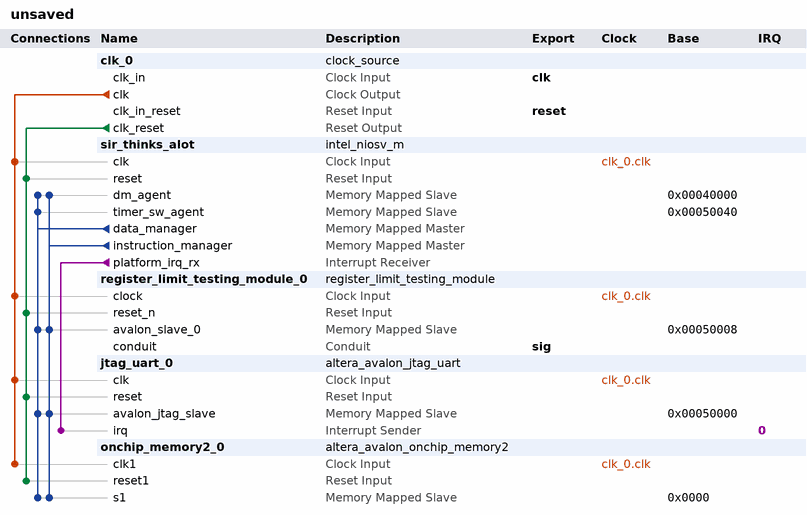
[diagram p0: system contents]
# Platform Designer (Qsys) system unsaved, Cyclone IV E EP4CE115F29C7
# Parameters at their usual value, and those the tool derives, are not listed.
package require -exact qsys 24.1
create_system unsaved
set_project_property DEVICE_FAMILY {Cyclone IV E}
set_project_property DEVICE EP4CE115F29C7

add_instance clk_0 clock_source 24.1
set_instance_parameter_value clk_0 clockFrequency 50000000

add_instance sir_thinks_alot intel_niosv_m 26.0.0
set_instance_parameter_value sir_thinks_alot enableAvalonInterface false
set_instance_parameter_value sir_thinks_alot enableDebugReset false
set_instance_parameter_value sir_thinks_alot enableECCLite false
set_instance_parameter_value sir_thinks_alot hartId 0
set_instance_parameter_value sir_thinks_alot interruptMode 0
set_instance_parameter_value sir_thinks_alot pipelineArch true
set_instance_parameter_value sir_thinks_alot resetSlave Absolute

add_instance register_limit_testing_module_0 register_limit_testing_module 1.0

add_instance jtag_uart_0 altera_avalon_jtag_uart 24.1
set_instance_parameter_value jtag_uart_0 simInteractiveOptions NO_INTERACTIVE_WINDOWS

add_instance onchip_memory2_0 altera_avalon_onchip_memory2 24.1
set_instance_parameter_value onchip_memory2_0 dataWidth 32
set_instance_parameter_value onchip_memory2_0 dualPort false
set_instance_parameter_value onchip_memory2_0 initMemContent true
set_instance_parameter_value onchip_memory2_0 initializationFileName onchip_mem.hex
set_instance_parameter_value onchip_memory2_0 memorySize 262144

# connections
add_connection clk_0.clk jtag_uart_0.clk clock
add_connection clk_0.clk onchip_memory2_0.clk1 clock
add_connection clk_0.clk register_limit_testing_module_0.clock clock
add_connection clk_0.clk sir_thinks_alot.clk clock
add_connection clk_0.clk_reset jtag_uart_0.reset reset
add_connection clk_0.clk_reset onchip_memory2_0.reset1 reset
add_connection clk_0.clk_reset register_limit_testing_module_0.reset_n reset
add_connection clk_0.clk_reset sir_thinks_alot.reset reset
add_connection sir_thinks_alot.data_manager jtag_uart_0.avalon_jtag_slave avalon
set_connection_parameter_value sir_thinks_alot.data_manager/jtag_uart_0.avalon_jtag_slave baseAddress 0x00050000
add_connection sir_thinks_alot.data_manager onchip_memory2_0.s1 avalon
set_connection_parameter_value sir_thinks_alot.data_manager/onchip_memory2_0.s1 baseAddress 0x0000
add_connection sir_thinks_alot.data_manager register_limit_testing_module_0.avalon_slave_0 avalon
set_connection_parameter_value sir_thinks_alot.data_manager/register_limit_testing_module_0.avalon_slave_0 baseAddress 0x00050008
add_connection sir_thinks_alot.data_manager sir_thinks_alot.dm_agent avalon
set_connection_parameter_value sir_thinks_alot.data_manager/sir_thinks_alot.dm_agent baseAddress 0x00040000
add_connection sir_thinks_alot.data_manager sir_thinks_alot.timer_sw_agent avalon
set_connection_parameter_value sir_thinks_alot.data_manager/sir_thinks_alot.timer_sw_agent baseAddress 0x00050040
add_connection sir_thinks_alot.instruction_manager jtag_uart_0.avalon_jtag_slave avalon
set_connection_parameter_value sir_thinks_alot.instruction_manager/jtag_uart_0.avalon_jtag_slave baseAddress 0x00050000
add_connection sir_thinks_alot.instruction_manager onchip_memory2_0.s1 avalon
set_connection_parameter_value sir_thinks_alot.instruction_manager/onchip_memory2_0.s1 baseAddress 0x0000
add_connection sir_thinks_alot.instruction_manager register_limit_testing_module_0.avalon_slave_0 avalon
set_connection_parameter_value sir_thinks_alot.instruction_manager/register_limit_testing_module_0.avalon_slave_0 baseAddress 0x00050008
add_connection sir_thinks_alot.instruction_manager sir_thinks_alot.dm_agent avalon
set_connection_parameter_value sir_thinks_alot.instruction_manager/sir_thinks_alot.dm_agent baseAddress 0x00040000
add_connection sir_thinks_alot.platform_irq_rx jtag_uart_0.irq interrupt
set_connection_parameter_value sir_thinks_alot.platform_irq_rx/jtag_uart_0.irq irqNumber 0

# exported interfaces
add_interface clk clock sink
set_interface_property clk EXPORT_OF clk_0.clk_in
add_interface reset reset sink
set_interface_property reset EXPORT_OF clk_0.clk_in_reset
add_interface sig conduit end
set_interface_property sig EXPORT_OF register_limit_testing_module_0.conduit

set_interconnect_requirement {$system} qsys_mm.clockCrossingAdapter HANDSHAKE
set_interconnect_requirement {$system} qsys_mm.enableEccProtection FALSE
set_interconnect_requirement {$system} qsys_mm.insertDefaultSlave FALSE
set_interconnect_requirement {$system} qsys_mm.maxAdditionalLatency 1

save_system unsaved.qsys
